# Altium schematic sheet D_INPUT.SchDoc
size A3; Date: *******; ApprovedBy: *******; CheckedBy: None; Author: *******; CompanyName: *******; DrawnBy: V.HIEU; Engineer: *******; Organization: *******; Address2: *******; Address3: *******; Address4: *******; DocumentNumber: Doc Num; Revision: V1.0; Email: truongvanhieu17102005@gmail.com; SheetNumber: 3; SheetTotal: 9; CurrentTime: *******; CurrentDate: *******; Time: *******; DocumentFullPathAndName: *******; DocumentName: *******; ModifiedDate: *******; ImagePath: *******; ProjectName: *******; Application_BuildNumber: *******
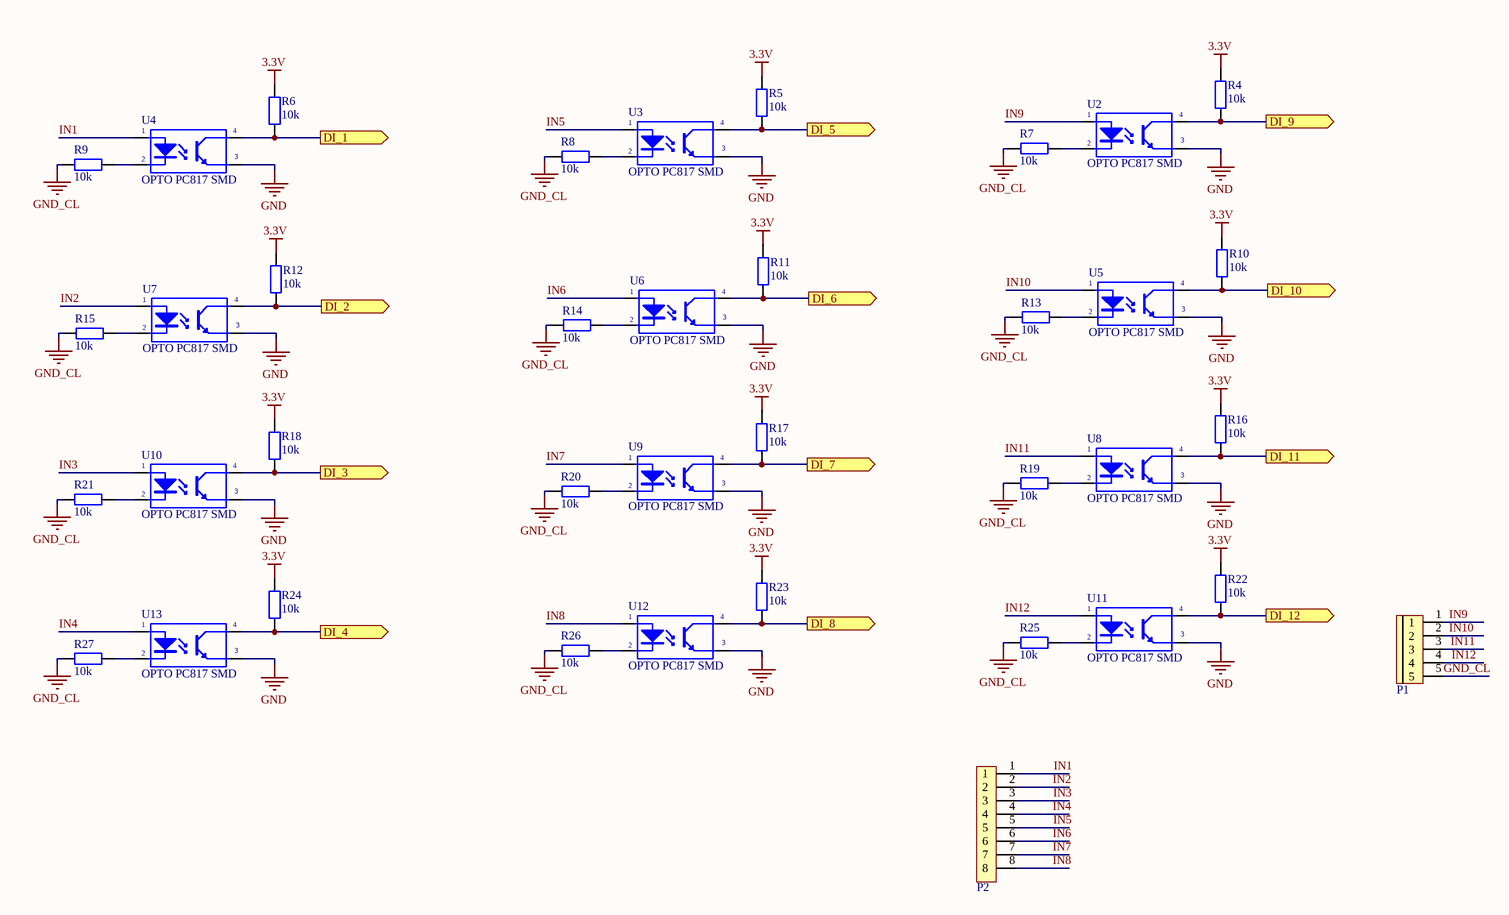
[diagram p0: D_INPUT.SchDoc]

## Parts
P1  CON 5 EDG5.08  [CON 5 5EDG5.08]  (value not drawn)
P2  CON 8 EDG5.08  [CON 8 8EDG5.08]  (value not drawn)
R4  10k  [tro smd 0805]
R5  10k  [tro smd 0805]
R6  10k  [tro smd 0805]
R7  10k  [tro smd 0805]
R8  10k  [tro smd 0805]
R9  10k  [tro smd 0805]
R10  10k  [tro smd 0805]
R11  10k  [tro smd 0805]
R12  10k  [tro smd 0805]
R13  10k  [tro smd 0805]
R14  10k  [tro smd 0805]
R15  10k  [tro smd 0805]
R16  10k  [tro smd 0805]
R17  10k  [tro smd 0805]
R18  10k  [tro smd 0805]
R19  10k  [tro smd 0805]
R20  10k  [tro smd 0805]
R21  10k  [tro smd 0805]
R22  10k  [tro smd 0805]
R23  10k  [tro smd 0805]
R24  10k  [tro smd 0805]
R25  10k  [tro smd 0805]
R26  10k  [tro smd 0805]
R27  10k  [tro smd 0805]
U2  OPTO PC817 SMD  [SOP4]
U3  OPTO PC817 SMD  [SOP4]
U4  OPTO PC817 SMD  [SOP4]
U5  OPTO PC817 SMD  [SOP4]
U6  OPTO PC817 SMD  [SOP4]
U7  OPTO PC817 SMD  [SOP4]
U8  OPTO PC817 SMD  [SOP4]
U9  OPTO PC817 SMD  [SOP4]
U10  OPTO PC817 SMD  [SOP4]
U11  OPTO PC817 SMD  [SOP4]
U12  OPTO PC817 SMD  [SOP4]
U13  OPTO PC817 SMD  [SOP4]

## Ports
DI_1 (out), DI_2 (out), DI_3 (out), DI_4 (out), DI_5 (out), DI_6 (out), DI_7 (out), DI_8 (out), DI_9 (out), DI_10 (out), DI_11 (out), DI_12 (out)

## Nets
3.3V: R4.1 R5.1 R6.1 R10.1 R11.1 R12.1 R16.1 R17.1 R18.1 R22.1 R23.1 R24.1
GND: U2.3(E) U3.3(E) U4.3(E) U5.3(E) U6.3(E) U7.3(E) U8.3(E) U9.3(E) U10.3(E) U11.3(E) U12.3(E) U13.3(E)
GND_CL: P1.5 R7.2 R8.2 R9.2 R13.2 R14.2 R15.2 R19.2 R20.2 R21.2 R25.2 R26.2 R27.2
DI_1: R6.2 U4.4(C) ; port DI_1
DI_2: R12.2 U7.4(C) ; port DI_2
DI_3: R18.2 U10.4(C) ; port DI_3
DI_4: R24.2 U13.4(C) ; port DI_4
DI_5: R5.2 U3.4(C) ; port DI_5
DI_6: R11.2 U6.4(C) ; port DI_6
DI_7: R17.2 U9.4(C) ; port DI_7
DI_8: R23.2 U12.4(C) ; port DI_8
DI_9: R4.2 U2.4(C) ; port DI_9
DI_10: R10.2 U5.4(C) ; port DI_10
DI_11: R16.2 U8.4(C) ; port DI_11
DI_12: R22.2 U11.4(C) ; port DI_12
IN1: P2.1 U4.1(A)
IN2: P2.2 U7.1(A)
IN3: P2.3 U10.1(A)
IN4: P2.4 U13.1(A)
IN5: P2.5 U3.1(A)
IN6: P2.6 U6.1(A)
IN7: P2.7 U9.1(A)
IN8: P2.8 U12.1(A)
IN9: P1.1 U2.1(A)
IN10: P1.2 U5.1(A)
IN11: P1.3 U8.1(A)
IN12: P1.4 U11.1(A)
NetR7_1: R7.1 U2.2(K)
NetR8_1: R8.1 U3.2(K)
NetR9_1: R9.1 U4.2(K)
NetR13_1: R13.1 U5.2(K)
NetR14_1: R14.1 U6.2(K)
NetR15_1: R15.1 U7.2(K)
NetR19_1: R19.1 U8.2(K)
NetR20_1: R20.1 U9.2(K)
NetR21_1: R21.1 U10.2(K)
NetR25_1: R25.1 U11.2(K)
NetR26_1: R26.1 U12.2(K)
NetR27_1: R27.1 U13.2(K)

## Notes on the sheet
- Title:
- Size:
- Drawn By:
- Page Contents:
- A3
- Number:
- Checked By:
- Revision:
- Date:
- File:
- License:
- Email:
- Time:
- Sheet
- Website:
- of

## Library data of the parts
P1 = CON 5 EDG5.08: Cắm; Ten_Linh_Kien: CON 5 2EDG5.08-5P 5.08MM ( Xanh Cong); Ma_Hang: MH003589; Kieu_Chan: *; Don_Vi: Con; Ghi_Chu: *; Chung_Loai: Cắm
P2 = CON 8 EDG5.08: Cắm; Ten_Linh_Kien: CON 8 2EDG5.08-8P 5.08MM ( Xanh Cong); Ma_Hang: MH000978; Don_Vi: Con; Ghi_Chu: *; Kieu_Chan: *; Chung_Loai: Cắm
R4-R27 = Tro 0805 1% 10k: Dán; Don_Vi: Con; So_Chan: 2; Ten_Linh_Kien: Trở 0805 1% 10k; Ma_Hang: MH005473; Chung_Loai: Dán; Kieu_Chan: *
U2-U13 = OPTO PC817 SMD: Single Opto; Value: PC817